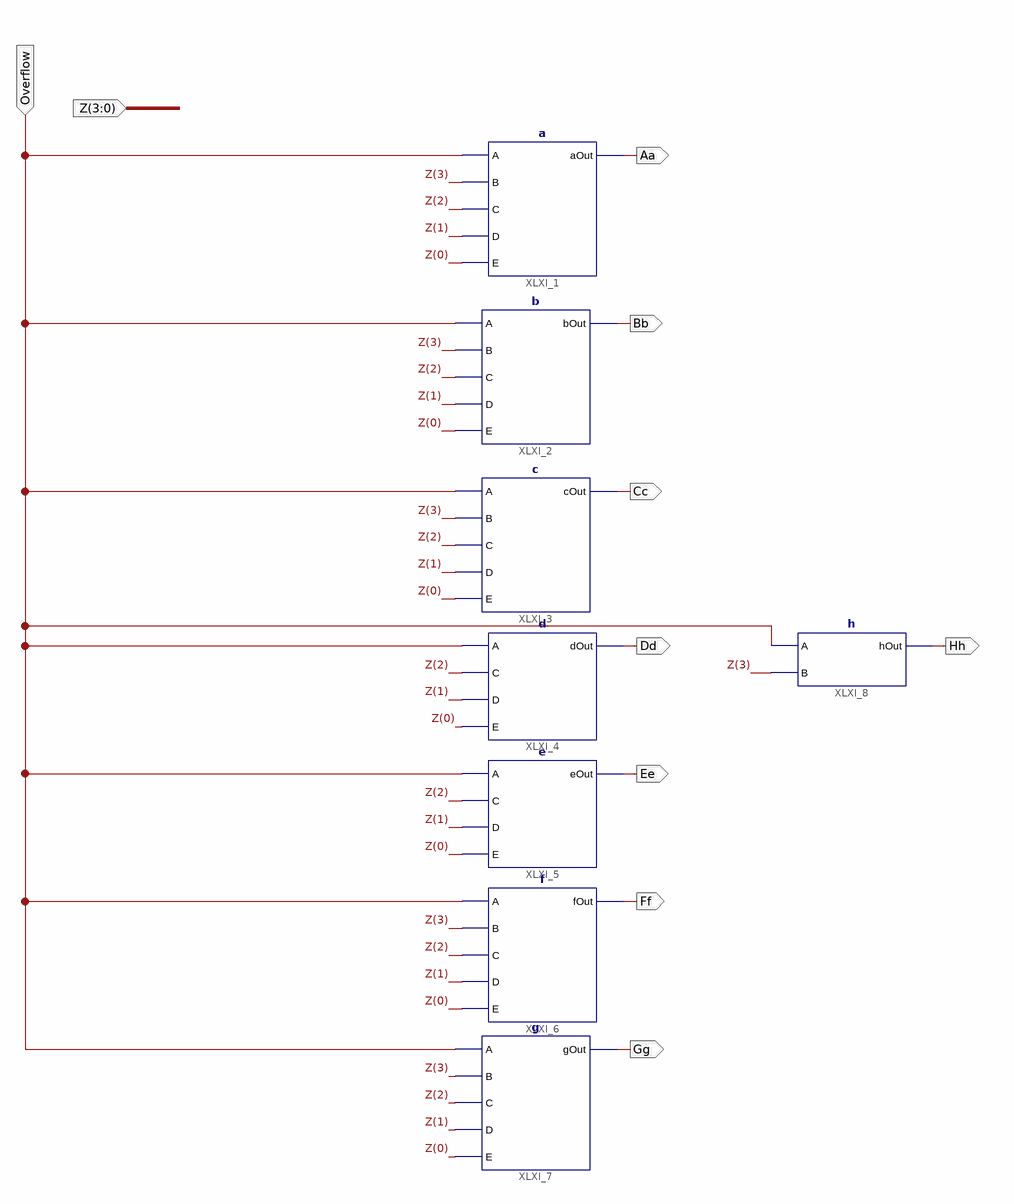
[diagram p0: schematic sheet 1]
// Xilinx ISE schematic Display.sch (xa9500xl) as structural Verilog: 8 symbols, 10 ports
module Display (
  input  Overflow,
  input  [3:0] Z,
  output Aa,
  output Bb,
  output Cc,
  output Dd,
  output Ee,
  output Ff,
  output Gg,
  output Hh
);

  a XLXI_1 (.A(Overflow), .E(Z[0]), .B(Z[3]), .C(Z[2]), .D(Z[1]), .aOut(Aa));
  b XLXI_2 (.A(Overflow), .B(Z[3]), .C(Z[2]), .D(Z[1]), .E(Z[0]), .bOut(Bb));
  c XLXI_3 (.A(Overflow), .B(Z[3]), .C(Z[2]), .D(Z[1]), .E(Z[0]), .cOut(Cc));
  d XLXI_4 (.A(Overflow), .C(Z[2]), .D(Z[1]), .E(Z[0]), .dOut(Dd));
  e XLXI_5 (.A(Overflow), .C(Z[2]), .D(Z[1]), .E(Z[0]), .eOut(Ee));
  f XLXI_6 (.A(Overflow), .B(Z[3]), .C(Z[2]), .D(Z[1]), .E(Z[0]), .fOut(Ff));
  g XLXI_7 (.A(Overflow), .B(Z[3]), .C(Z[2]), .D(Z[1]), .E(Z[0]), .gOut(Gg));
  h XLXI_8 (.A(Overflow), .B(Z[3]), .hOut(Hh));
endmodule
